# EAGLE schematic DressCode (EAGLE 6.4)
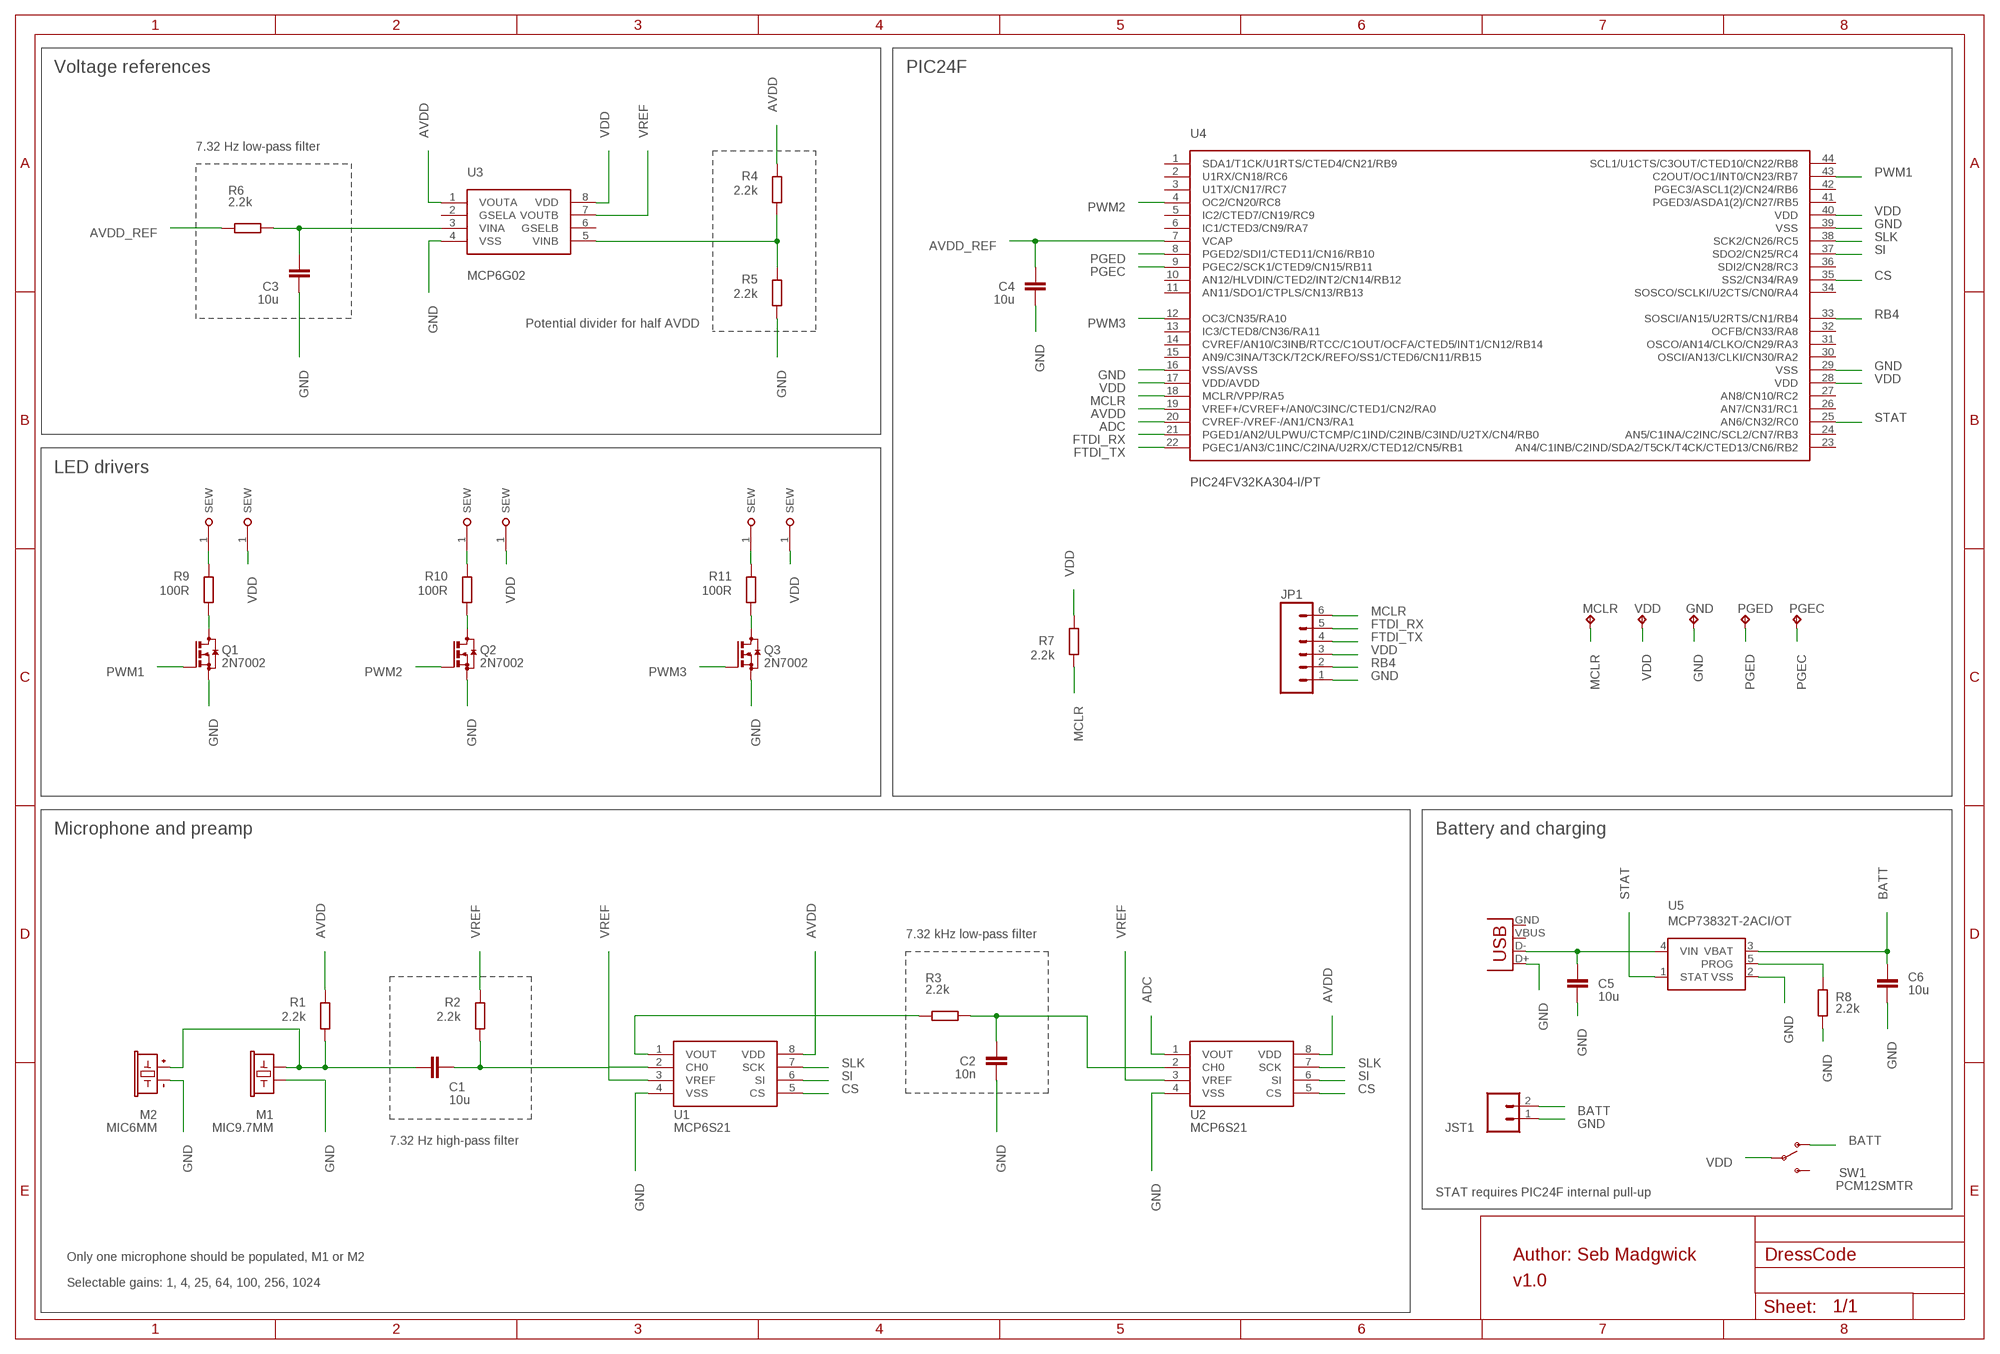
[diagram p0: schematic, sheet 1]

## Parts
C1  10u  C-EUC0805  [C0805]
C2  10n  C-EUC0805  [C0805]
C3  10u  C-EUC0805  [C0805]
C4  10u  C-EUC0805  [C0805]
C5  10u  C-EUC0805  [C0805]
C6  10u  C-EUC0805  [C0805]
GND  TPTP16R  [TP16R]
JP1  M06SIP  [1X06]
JST1  M02-JST-2MM-SMT  [JST-2-SMD]
M1  MIC9.7MM  [MIC-9.7MM]
M2  MIC6MM  [MIC-SMD]
MCLR  TPTP16R  [TP16R]
PGEC  TPTP16R  [TP16R]
PGED  TPTP16R  [TP16R]
Q1  2N7002  BSS123  [SOT23]
Q2  2N7002  BSS123  [SOT23]
Q3  2N7002  BSS123  [SOT23]
R1  2.2k  R-EU_R0805  [R0805]
R2  2.2k  R-EU_R0805  [R0805]
R3  2.2k  R-EU_R0805  [R0805]
R4  2.2k  R-EU_R0805  [R0805]
R5  2.2k  R-EU_R0805  [R0805]
R6  2.2k  R-EU_R0805  [R0805]
R7  2.2k  R-EU_R0805  [R0805]
R8  2.2k  R-EU_R0805  [R0805]
R9  100R  R-EU_R0805  [R0805]
R10  100R  R-EU_R0805  [R0805]
R11  100R  R-EU_R0805  [R0805]
SW1  PCM12SMTR  [PCM12SMTR]
U1  MCP6S21  [SOIC-8]
U2  MCP6S21  [SOIC-8]
U3  MCP6G02  [SOIC-8]
U4  PIC24FV32KA304-I/PT  [TQFP44]
U5  MCP73832T-2ACI/OT  MCP73831  [SOT23-5]
U$4  DRESSCODE_SEW_PADC  [DRESSCODE_SEW_PAD_CIRC]
U$5  DRESSCODE_SEW_PADC  [DRESSCODE_SEW_PAD_CIRC]
U$6  DRESSCODE_SEW_PADC  [DRESSCODE_SEW_PAD_CIRC]
U$7  DRESSCODE_SEW_PADS  [DRESSCODE_SEW_PAD_SQR]
U$8  DRESSCODE_SEW_PADS  [DRESSCODE_SEW_PAD_SQR]
U$10  DRESSCODE_SEW_PADS  [DRESSCODE_SEW_PAD_SQR]
USB1  USB-MICROB  [USB-MICROB]
VDD  TPTP16R  [TP16R]

## Nets
ADC: U2.1(VOUT) U4.20(CVREF-/VREF-/AN1/CN3/RA1)
AVDD: R1.2 R4.2 U1.8(VDD) U2.8(VDD) U3.1(VOUTA) U4.19(VREF+/CVREF+/AN0/C3INC/CTED1/CN2/RA0)
AVDD_REF: C4.2 R6.1 U4.7(VCAP)
BATT: C6.2 JST1.2 SW1.1(O) U5.3(VBAT)
CS: U1.5(CS) U2.5(CS) U4.35(SS2/CN34/RA9)
FTDI_RX: JP1.5 U4.21(PGED1/AN2/ULPWU/CTCMP/C1IND/C2INB/C3IND/U2TX/CN4/RB0)
FTDI_TX: JP1.4 U4.22(PGEC1/AN3/C1INC/C2INA/U2RX/CTED12/CN5/RB1)
GND: C2.2 C3.1 C4.1 C5.1 C6.1 GND.TP JP1.1 JST1.1 M1.2 M2.- Q1.2(S) Q2.2(S) Q3.2(S) R5.1 R8.1 U1.4(VSS) U2.4(VSS) U3.4(VSS) U4.16(VSS/AVSS) U4.29(VSS) U4.39(VSS) U5.2(VSS) USB1.D+
MCLR: JP1.6 MCLR.TP R7.1 U4.18(MCLR/VPP/RA5)
N$1: C1.1 M1.1 M2.+ R1.1
N$2: C1.2 R2.1 U1.2(CH0)
N$3: C2.1 R3.2 U2.2(CH0)
N$4: R3.1 U1.1(VOUT)
N$5: C3.2 R6.2 U3.3(VINA)
N$6: R4.1 R5.2 U3.5(VINB)
N$9: Q1.3(D) R9.1
N$10: Q2.3(D) R10.1
N$11: Q3.3(D) R11.1
N$12: R9.2 U$7.1(SEW)
N$13: R10.2 U$8.1(SEW)
N$14: R11.2 U$10.1(SEW)
N$15: R8.2 U5.5(PROG)
PGEC: PGEC.TP U4.9(PGEC2/SCK1/CTED9/CN15/RB11)
PGED: PGED.TP U4.8(PGED2/SDI1/CTED11/CN16/RB10)
PWM1: Q1.1(G) U4.43(C2OUT/OC1/INT0/CN23/RB7)
PWM2: Q2.1(G) U4.4(OC2/CN20/RC8)
PWM3: Q3.1(G) U4.12(OC3/CN35/RA10)
RB4: JP1.2 U4.33(SOSCI/AN15/U2RTS/CN1/RB4)
SI: U1.6(SI) U2.6(SI) U4.37(SDO2/CN25/RC4)
SLK: U1.7(SCK) U2.7(SCK) U4.38(SCK2/CN26/RC5)
STAT: U4.25(AN6/CN32/RC0) U5.1(STAT)
USB1: C5.2 U5.4(VIN) USB1.D-
VDD: JP1.3 R7.2 SW1.2(P) U3.8(VDD) U4.17(VDD/AVDD) U4.28(VDD) U4.40(VDD) U$4.1(SEW) U$5.1(SEW) U$6.1(SEW) VDD.TP
VREF: R2.2 U1.3(VREF) U2.3(VREF) U3.7(VOUTB)
Unconnected: SW1.3(S) U3.2(GSELA) U3.6(GSELB) U4.1(SDA1/T1CK/U1RTS/CTED4/CN21/RB9) U4.2(U1RX/CN18/RC6) U4.3(U1TX/CN17/RC7) U4.5(IC2/CTED7/CN19/RC9) U4.6(IC1/CTED3/CN9/RA7) U4.10(AN12/HLVDIN/CTED2/INT2/CN14/RB12) U4.11(AN11/SDO1/CTPLS/CN13/RB13) U4.13(IC3/CTED8/CN36/RA11) U4.14(CVREF/AN10/C3INB/RTCC/C1OUT/OCFA/CTED5/INT1/CN12/RB14) U4.15(AN9/C3INA/T3CK/T2CK/REFO/SS1/CTED6/CN11/RB15) U4.23(AN4/C1INB/C2IND/SDA2/T5CK/T4CK/CTED13/CN6/RB2) U4.24(AN5/C1INA/C2INC/SCL2/CN7/RB3) U4.26(AN7/CN31/RC1) U4.27(AN8/CN10/RC2) U4.30(OSCI/AN13/CLKI/CN30/RA2) U4.31(OSCO/AN14/CLKO/CN29/RA3) U4.32(OCFB/CN33/RA8) U4.34(SOSCO/SCLKI/U2CTS/CN0/RA4) U4.36(SDI2/CN28/RC3) U4.41(PGED3/ASDA1(2)/CN27/RB5) U4.42(PGEC3/ASCL1(2)/CN24/RB6) U4.44(SCL1/U1CTS/C3OUT/CTED10/CN22/RB8) USB1.GND USB1.VBUS

## Notes on the sheet
- Voltage references | PIC24F
- 7.32 Hz low-pass filter
- Potential divider for half AVDD
- LED drivers
- Microphone and preamp | Battery and charging
- 7.32 kHz low-pass filter
- 7.32 Hz high-pass filter
- STAT requires PIC24F internal pull-up
- Only one microphone should be populated, M1 or M2 | Author: Seb Madgwick
- Selectable gains: 1, 4, 25, 64, 100, 256, 1024 | v1.0

## Library data of the parts
C1-C6 = rcl:C-EU: CAPACITOR, European symbol
GND MCLR PGEC PGED VDD = testpad:TP: Test pad
JP1 = SparkFun:M06: Header 6 Standard 6-pin 0.1" header. Use with straight break away headers (SKU : PRT-00116), right angle break away headers (PRT-00553), swiss pins (PRT-00743), machine pins (PRT-00117), and female headers (PRT-00115). Molex polarized connector foot print use with SKU : PRT-08094 with associated crimp pins and housings. NOTES ON THE VARIANTS LOCK and LOCK_LONGPADS... This footprint was designed to help hold the alignment of a through-hole component (i.e. 6-pin header) while soldering it into place. You may notice that each hole has been shifted either up or down by 0.005 of an inch from it's more standard position (which is a perfectly straight line). This slight alteration caused the pins (the squares in the middle) to touch the edges of the holes. Because they are alternating, it causes a "brace" to hold the component in place. 0.005 has proven to be the perfect amount of "off-center" position when using our standard breakaway headers. Although looks a little odd when you look at the bare footprint, once you have a header in there, the alteration is very hard to notice. Also, if you push a header all the way into place, it is covered up entirely on the bottom side. This idea of altering the position of holes to aid alignment will be further integrated into the Sparkfun Library for other footprints. It can help hold any component with 3 or more connection pins.
JST1 = SparkFun_08_2011:M02: Header 2 Standard 2-pin 0.1" header. Use with straight break away headers (SKU : PRT-00116), right angle break away headers (PRT-00553), swiss pins (PRT-00743), machine pins (PRT-00117), and female headers (PRT-00115). Molex polarized connector foot print use with SKU : PRT-08233 with associated crimp pins and housings.
M1 = SparkFun:MIC: Microphone Omni-directional electret microphone. 9.7mm standard diameter.
M2 = x-io:MIC: Microphone Omni-directional electret microphone. 9.7mm standard diameter.
Q1-Q3 = transistor-small-signal:BSS123: N-CHANNEL MOS FET
R1-R11 = rcl:R-EU_: RESISTOR, European symbol
SW1 = SparkFun0modified:PCM12SMTR
U1 U2 = x-io:MCP6S21
U3 = x-io:MCP6G02
U4 = x-io:PIC24FV32KA304
U5 = SparkFun_08_2011:MCP73831: Microchip's MCP73831 Miniature single cell, fully integrated Li-Ion, Li-polymer charge management controller http://ww1.microchip.com/downloads/en/DeviceDoc/21984a.pdf
U$4-U$8 U$10 = x-io:DRESSCODE_SEW_PAD
USB1 = SparkFun_08_2011:USB: USB Connectors USB-B-PTH is fully proven SKU : PRT-00139 USB-miniB is fully proven SKU : PRT-00587 USB-A-PCB is untested. USB-A-H is throughly reviewed, but untested. Spark Fun Electronics SKU : PRT-00437 USB-B-SMT is throughly reviewed, but untested. Needs silkscreen touching up. USB-A-S has not been used/tested USB-MB-H has not been used/tested